# EAGLE design krajBB-Mojžiš_Matej (EAGLE 7.7.0)
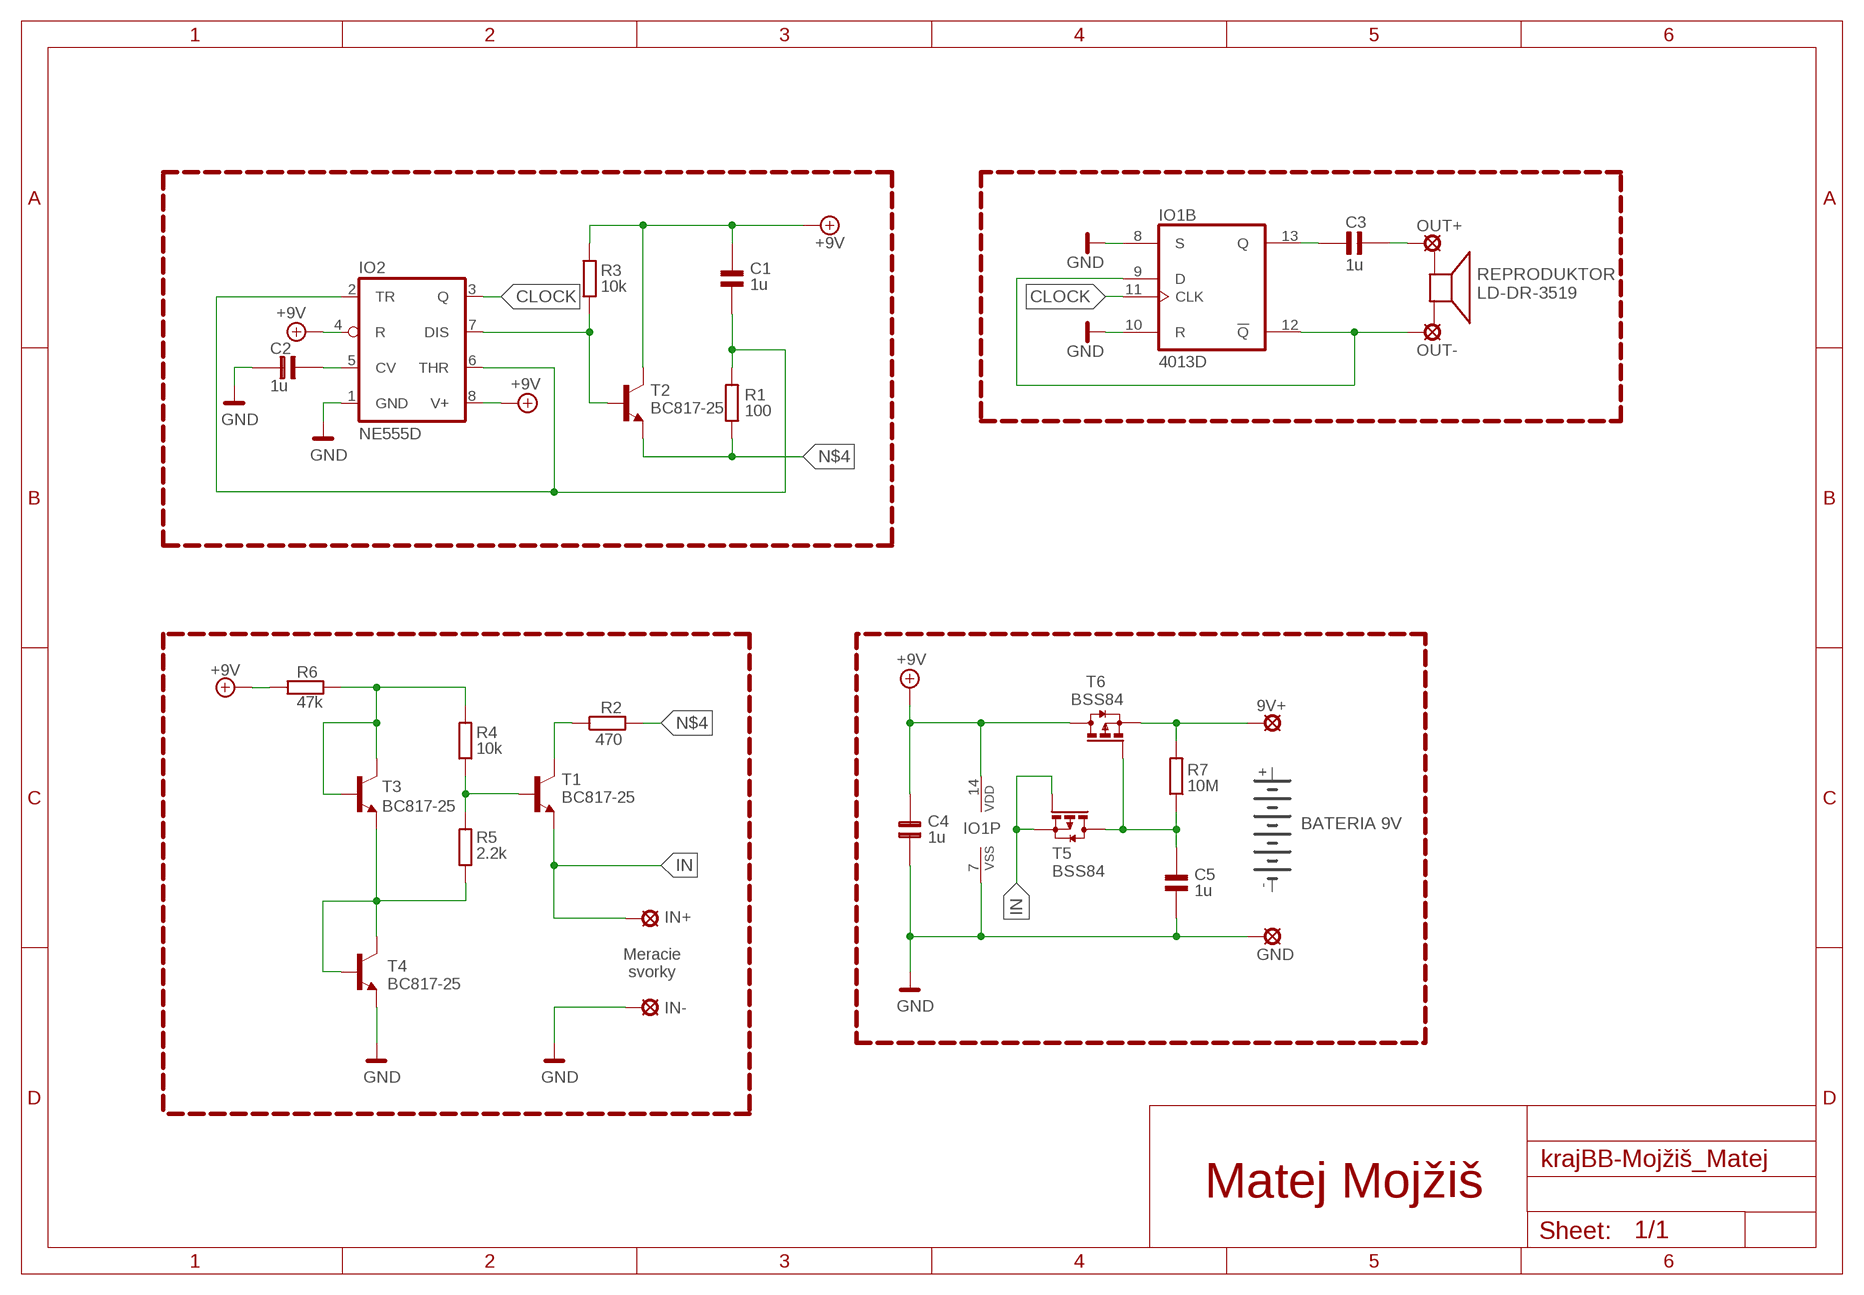
[diagram p0: schematic, sheet 1]

## Parts
9V+  SMD3X3  [SMD3X3]
C1  1u  C1206TOP  [1206]
C2  1u  C1206TOP  [1206]
C3  1u  C1206TOP  [1206]
C4  1u  C1206TOP  [1206]
C5  1u  C1206TOP  [1206]
GND  SMD3X3  [SMD3X3]
IN+  SMD3X3  [SMD3X3]
IN-  SMD3X3  [SMD3X3]
IO1  4013D  [SO14]
IO2  NE555D  [SO08]
OUT+  SMD3X3  [SMD3X3]
OUT-  SMD3X3  [SMD3X3]
R1  100  R1206TOP  [1206]
R2  470  R1206TOP  [1206]
R3  10k  R1206TOP  [1206]
R4  10k  R1206TOP  [1206]
R5  2.2k  R1206TOP  [1206]
R6  47k  R1206TOP  [1206]
R7  10M  R1206TOP  [1206]
REPRODUKTOR  LD-DR-3519  [LD-DR-3519]
T1  BC817-25  BC817-25SMD  [SOT23-BEC]
T2  BC817-25  BC817-25SMD  [SOT23-BEC]
T3  BC817-25  BC817-25SMD  [SOT23-BEC]
T4  BC817-25  BC817-25SMD  [SOT23-BEC]
T5  BSS84  [SOT23]
T6  BSS84  [SOT23]
U$1  9VBATTERY  [9VBATTERY]

## Nets
+9V: C1.2 C4.2 IO1.14(P:VDD) IO2.4(R) IO2.8(V+) R3.2 R6.2 T2.C T6.3(D)
CLOCK: IO1.11(B:CLK) IO2.3(Q)
GND: C2.1 C4.1 C5.1 GND.P$1(MP) IN-.P$1(MP) IO1.7(P:VSS) IO1.8(B:S) IO1.10(B:R) IO2.1(GND) T4.E
IN: IN+.P$1(MP) T1.E T5.1(G) T5.2(S)
N$1: IO2.7(DIS) R3.1 T2.B
N$3: 9V+.P$1(MP) R7.2 T6.2(S)
N$4: R1.1 R2.2 T2.E
N$5: R4.2 R6.1 T3.B T3.C
N$6: C2.2 IO2.5(CV)
N$8: R4.1 R5.2 T1.B
N$9: R2.1 T1.C
N$11: IO1.9(B:D) IO1.12(B:!Q) OUT-.P$1(MP)
N$13: C5.2 R7.1 T5.3(D) T6.1(G)
N$15: C3.1 IO1.13(B:Q)
N$16: C3.2 OUT+.P$1(MP)
N$17: R5.1 T3.E T4.B T4.C
N$18: C1.1 IO2.2(TR) IO2.6(THR) R1.2
Unconnected: IO1.1(A:Q) IO1.2(A:!Q) IO1.3(A:CLK) IO1.4(A:R) IO1.5(A:D) IO1.6(A:S) REPRODUKTOR.P$1 REPRODUKTOR.P$2

## Notes on the sheet
- BATERIA 9V
- Meracie
  svorky
- Matej Mojžiš

## Library data of the parts
9V+ GND IN+ IN- OUT+ OUT- = solpad:SMD3X3
C1-C5 = rcl:C1206: 1206 capacitor, top layer
IO1 = 40xx:4013: Dual D FLIP FLOP, set/reset
IO2 = linear:*555: TIMER
R1-R7 = rcl:R1206: 1206 resistor, top layer
REPRODUKTOR = buzzer:LD-DR-3519
T1-T4 = transistor-npn:BC817*: NPN Transistor
T5 T6 = transistor-small-signal:BSS84: P-CHANNEL MOS FET
U$1 = battery:9VBATTERY: 9V battery symbol and placeholder

## Board
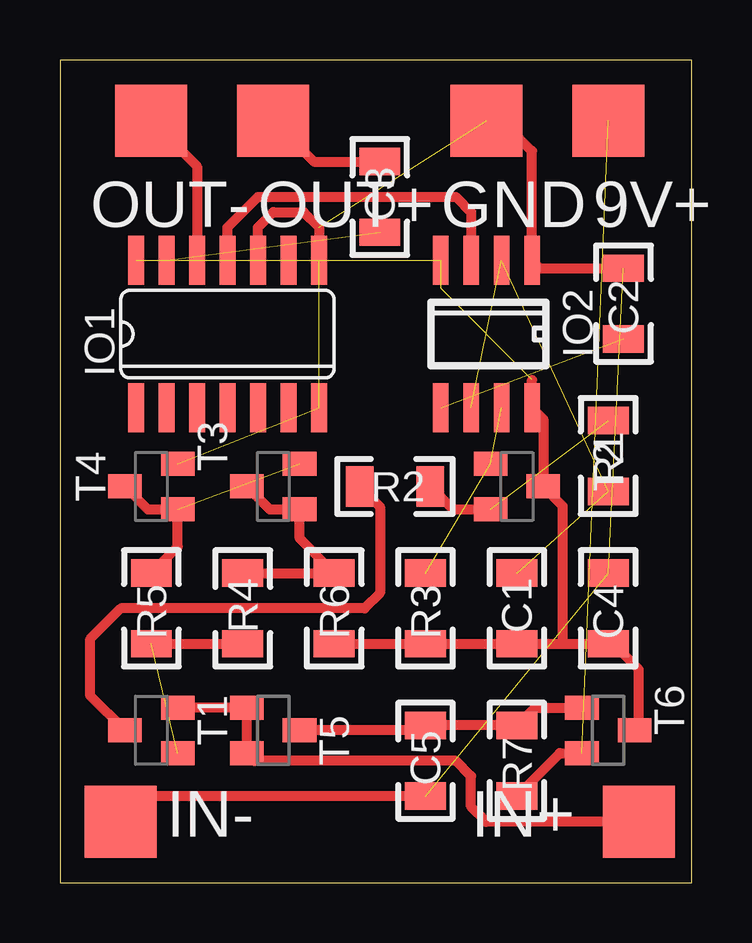
[diagram p1: board, top side]

Size 26.34 x 34.28 mm. Coordinates in mm from the lower left corner, seen from the top.
Outline: 0,0 26.34,0 26.34,34.28 0,34.28 0,0
Copper layers (1*16): Top 0.035mm / dielectric 1.5mm / Bottom 0.035mm
Design rules "default *": minimum track width 10mil, minimum drill 24mil, track to track 8mil, track to pad 8mil, pad to pad 8mil, via to via 8mil, smd to smd 8mil, copper to edge 16mil, drill to drill 8mil, minimum pad ring 10mil, minimum via ring 8mil, stop-mask expansion 4mil, vias tented up to drill 0mil, thermal gap 10mil

### Footprints (pad centres in the part's own frame; a part is rotated, then mirrored left to right if it is on the bottom)
SMD3X3 = smd 3 x 3: P$1 0,0
1206 = smd 1.143 x 1.702: 1 -1.473,0; 2 1.473,0
SO14 = smd 0.66 x 2.032: 1 -3.81,-3.073; 2 -2.54,-3.073; 3 -1.27,-3.073; 4 0,-3.073; 5 1.27,-3.073; 6 2.54,-3.073; 7 3.81,-3.073; 8 3.81,3.073; 9 2.54,3.073; 10 1.27,3.073; 11 0,3.073; 12 -1.27,3.073; 13 -2.54,3.073; 14 -3.81,3.073
SO08 = smd 0.66 x 2.032: 1 -1.905,-3.073; 2 -0.635,-3.073; 3 0.635,-3.073; 4 1.905,-3.073; 5 1.905,3.073; 6 0.635,3.073; 7 -0.635,3.073; 8 -1.905,3.073
LD-DR-3519 = drill 1 pad 1.93 long: P$1 -3,-15; P$2 3,-15
SOT23-BEC = smd 1 x 1.4: B -0.95,-1.1; C 0,1.1; E 0.95,-1.1
SOT23 = smd 1 x 1.4: 1 -0.95,-1.1; 2 0.95,-1.1; 3 0,1.1

### Placement (x,y rotation side)
9V+  22.86,31.75 0 top
C1  19.05,11.43 270 top
C2  23.5,24.13 270 top
C3  13.34,28.57 90 top
C4  22.86,11.43 270 top
C5  15.24,5.08 90 top
GND  17.78,31.75 0 top
IN+  24.13,2.54 0 top
IN-  2.54,2.54 0 top
IO1  6.99,22.86 0 top
IO2  17.78,22.86 180 top
OUT+  8.89,31.75 0 top
OUT-  3.81,31.75 0 top
R1  22.86,17.78 270 top
R2  13.97,16.51 0 top
R3  15.24,11.43 270 top
R4  7.62,11.43 90 top
R5  3.81,11.43 270 top
R6  11.43,11.43 270 top
R7  19.05,5.08 270 top
REPRODUKTOR  48.9,56.52 0 top  (outside the outline)
T1  3.81,6.35 90 top
T2  19.05,16.51 270 top
T3  8.89,16.51 90 top
T4  3.81,16.51 90 top
T5  8.89,6.35 270 top
T6  22.86,6.35 270 top
U$1  44.45,24.13 0 top  (outside the outline)

### Tracks (layer width: path | path; a pad name or v marks a point on that pad's centre or on a via)
+9V  (3 unrouted)
  Top 0.406: R6.2 R3.2 C1.2 20.95,9.96 | 20.95,9.96 C4.2 23.06,9.96 24.13,8.89 24.13,6.52 T6.3 | 20.95,9.96 20.95,15.71 T2.C 20.15,19.32 IO2.8 19.68,20.95
CLOCK
  Top 0.406: IO1.11 6.99,27.3 8.26,28.57 16.51,28.57 17.14,27.94 IO2.3
GND  (5 unrouted)
  Top 0.406: IO1.10 8.26,27.3 8.89,27.94 10.16,27.94 10.79,27.3 IO1.8 | C2.1 20.02,25.6 IO2.1 19.68,30.48 18.41,31.75 GND.P$1 | C5.1 3.61,3.61 IN-.P$1
IN
  Top 0.406: T1.E T5.1 T5.2 8.11,5.08 16.51,5.08 17.14,4.45 17.14,3.17 17.78,2.54 IN+.P$1
N$1  (2 unrouted)
N$3  (1 unrouted)
  Top 0.406: R7.2 20.84,5.4 T6.2
N$4  (1 unrouted)
  Top 0.406: R2.2 16.39,15.56 T2.E
N$5
  Top 0.406: R4.2 R6.1 9.99,14.34 T3.B 8.74,15.56 T3.C
N$6  (1 unrouted)
N$8  (1 unrouted)
  Top 0.406: R5.2 R4.1
N$9
  Top 0.406: T1.C 1.27,7.79 1.27,10.16 2.54,11.43 12.7,11.43 13.34,12.06 13.34,15.67 R2.1
N$11  (1 unrouted)
  Top 0.406: OUT-.P$1 5.71,29.84 IO1.12
N$13
  Top 0.406: T6.1 19.8,7.3 R7.1 C5.2 15.04,6.35 T5.3
N$15  (1 unrouted)
N$16
  Top 0.406: OUT+.P$1 10.59,30.05 C3.2
N$17  (1 unrouted)
  Top 0.406: T4.C 3.66,15.56 T4.B 4.91,14 R5.1
N$18  (3 unrouted)